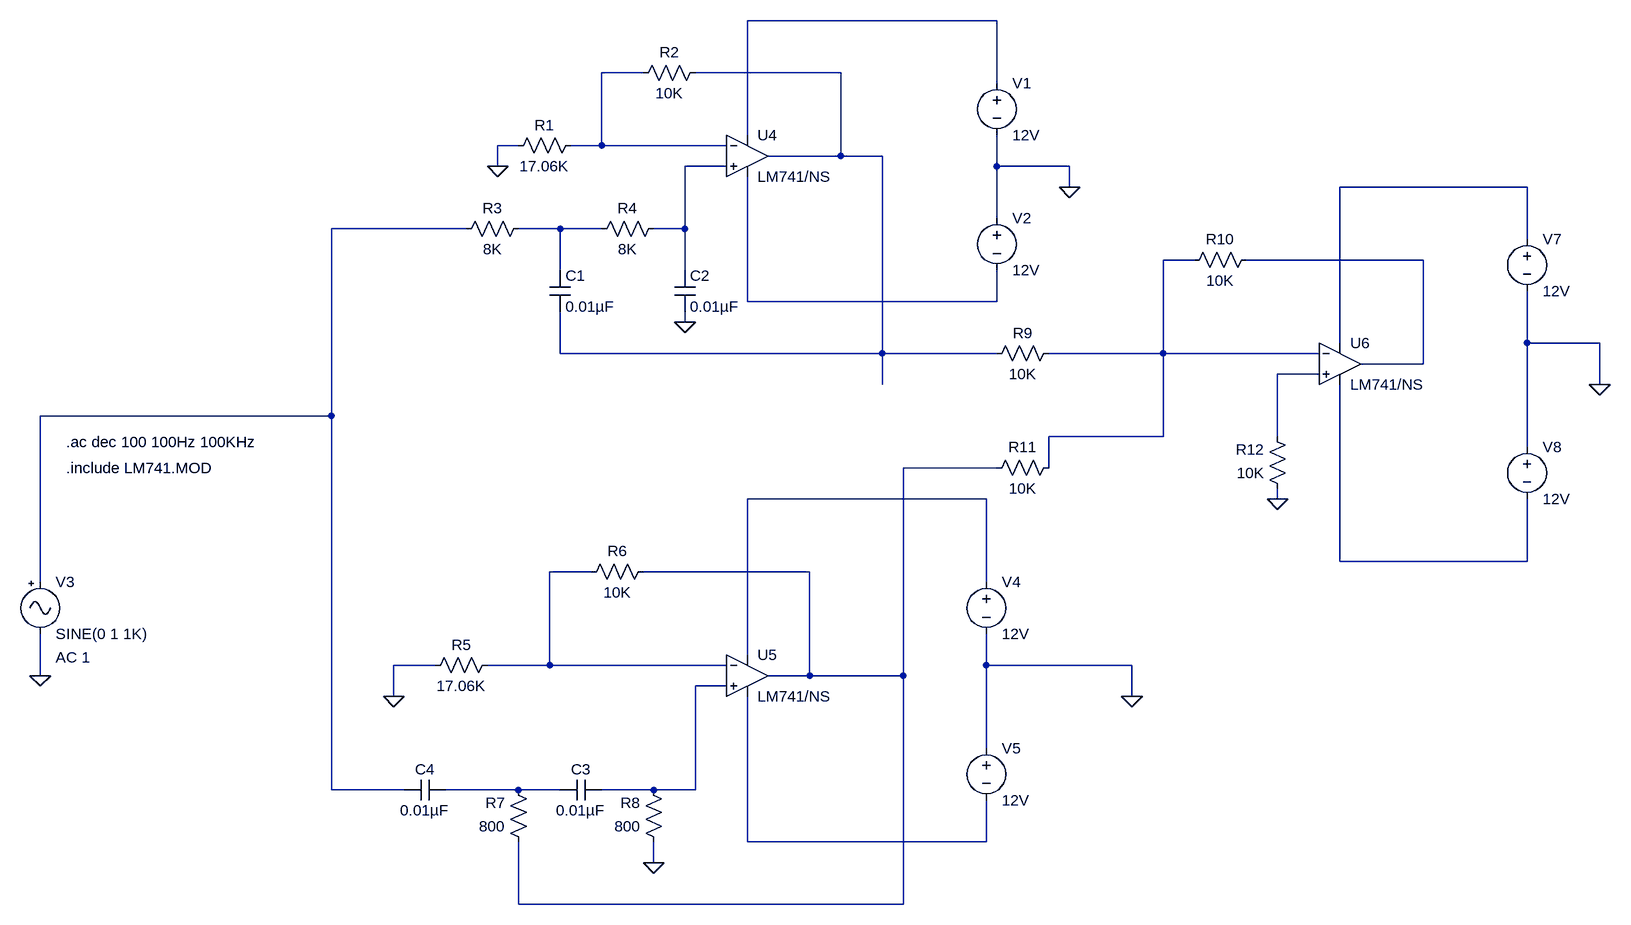
[diagram p0: schematic Band Reject Filter.asc]
Band Reject Filter.asc, the LTspice schematic file:
Version 4
SHEET 1 2224 1444
WIRE 608 -16 224 -16
WIRE 64 64 0 64
WIRE 368 64 144 64
WIRE 608 80 608 -16
WIRE 224 160 224 -16
WIRE -128 176 -160 176
WIRE 0 176 0 64
WIRE 0 176 -48 176
WIRE 192 176 0 176
WIRE 368 192 368 64
WIRE 368 192 256 192
WIRE 432 192 368 192
WIRE -160 208 -160 176
WIRE 192 208 128 208
WIRE 608 208 608 160
WIRE 720 208 608 208
WIRE 720 240 720 208
WIRE 1424 240 1136 240
WIRE 608 288 608 208
WIRE -208 304 -416 304
WIRE -64 304 -128 304
WIRE 0 304 -64 304
WIRE 128 304 128 208
WIRE 128 304 80 304
WIRE 1424 320 1424 240
WIRE 912 352 864 352
WIRE 1264 352 992 352
WIRE -64 368 -64 304
WIRE 128 368 128 304
WIRE 224 416 224 224
WIRE 608 416 608 368
WIRE 608 416 224 416
WIRE 128 448 128 432
WIRE 1136 480 1136 240
WIRE 1424 480 1424 400
WIRE 1536 480 1424 480
WIRE -64 496 -64 432
WIRE 432 496 432 192
WIRE 432 496 -64 496
WIRE 608 496 432 496
WIRE 864 496 864 352
WIRE 864 496 688 496
WIRE 1104 496 864 496
WIRE 1264 512 1264 352
WIRE 1264 512 1168 512
WIRE 1104 528 1040 528
WIRE 432 544 432 496
WIRE 1536 544 1536 480
WIRE -416 592 -416 304
WIRE -416 592 -864 592
WIRE 864 624 864 496
WIRE 864 624 688 624
WIRE 1040 624 1040 528
WIRE 1424 640 1424 480
WIRE 608 672 464 672
WIRE 688 672 688 624
WIRE 592 720 224 720
WIRE 1040 720 1040 704
WIRE 1136 816 1136 544
WIRE 1424 816 1424 720
WIRE 1424 816 1136 816
WIRE -16 832 -80 832
WIRE 320 832 64 832
WIRE -864 848 -864 592
WIRE 592 848 592 720
WIRE 224 960 224 720
WIRE -256 976 -320 976
WIRE -80 976 -80 832
WIRE -80 976 -176 976
WIRE 192 976 -80 976
WIRE 592 976 592 928
WIRE 816 976 592 976
WIRE -864 992 -864 928
WIRE 320 992 320 832
WIRE 320 992 256 992
WIRE 464 992 464 672
WIRE 464 992 320 992
WIRE 192 1008 144 1008
WIRE -320 1024 -320 976
WIRE 816 1024 816 976
WIRE 592 1104 592 976
WIRE -416 1168 -416 592
WIRE -304 1168 -416 1168
WIRE -128 1168 -240 1168
WIRE -64 1168 -128 1168
WIRE 80 1168 0 1168
WIRE 144 1168 144 1008
WIRE 144 1168 80 1168
WIRE 224 1248 224 1024
WIRE 592 1248 592 1184
WIRE 592 1248 224 1248
WIRE 80 1280 80 1248
WIRE -128 1344 -128 1248
WIRE 464 1344 464 992
WIRE 464 1344 -128 1344
FLAG 720 240 0
FLAG 128 448 0
FLAG -160 208 0
FLAG 80 1280 0
FLAG -320 1024 0
FLAG 816 1024 0
FLAG 1040 720 0
FLAG -864 992 0
FLAG 1536 544 0
SYMBOL res -32 160 R90
WINDOW 0 0 56 VBottom 2
WINDOW 3 32 56 VTop 2
SYMATTR InstName R1
SYMATTR Value 17.06K
SYMBOL res 160 48 R90
WINDOW 0 0 56 VBottom 2
WINDOW 3 32 56 VTop 2
SYMATTR InstName R2
SYMATTR Value 10K
SYMBOL res -112 288 R90
WINDOW 0 0 56 VBottom 2
WINDOW 3 32 56 VTop 2
SYMATTR InstName R3
SYMATTR Value 8K
SYMBOL res 96 288 R90
WINDOW 0 0 56 VBottom 2
WINDOW 3 32 56 VTop 2
SYMATTR InstName R4
SYMATTR Value 8K
SYMBOL cap -80 368 R0
SYMATTR InstName C1
SYMATTR Value 0.01µF
SYMBOL cap 112 368 R0
SYMATTR InstName C2
SYMATTR Value 0.01µF
SYMBOL voltage 608 64 R0
SYMATTR InstName V1
SYMATTR Value 12V
SYMBOL voltage 608 272 R0
SYMATTR InstName V2
SYMATTR Value 12V
SYMBOL res -160 960 R90
WINDOW 0 0 56 VBottom 2
WINDOW 3 32 56 VTop 2
SYMATTR InstName R5
SYMATTR Value 17.06K
SYMBOL res 80 816 R90
WINDOW 0 0 56 VBottom 2
WINDOW 3 32 56 VTop 2
SYMATTR InstName R6
SYMATTR Value 10K
SYMBOL res -112 1264 R180
WINDOW 0 36 76 Left 2
WINDOW 3 36 40 Left 2
SYMATTR InstName R7
SYMATTR Value 800
SYMBOL res 96 1264 R180
WINDOW 0 36 76 Left 2
WINDOW 3 36 40 Left 2
SYMATTR InstName R8
SYMATTR Value 800
SYMBOL cap 0 1152 R90
WINDOW 0 0 32 VBottom 2
WINDOW 3 32 32 VTop 2
SYMATTR InstName C3
SYMATTR Value 0.01µF
SYMBOL cap -240 1152 R90
WINDOW 0 0 32 VBottom 2
WINDOW 3 32 32 VTop 2
SYMATTR InstName C4
SYMATTR Value 0.01µF
SYMBOL voltage 592 832 R0
SYMATTR InstName V4
SYMATTR Value 12V
SYMBOL voltage 592 1088 R0
SYMATTR InstName V5
SYMATTR Value 12V
SYMBOL res 1056 720 R180
WINDOW 0 36 76 Left 2
WINDOW 3 36 40 Left 2
SYMATTR InstName R12
SYMATTR Value 10K
SYMBOL voltage 1424 304 R0
SYMATTR InstName V7
SYMATTR Value 12V
SYMBOL voltage 1424 624 R0
SYMATTR InstName V8
SYMATTR Value 12V
SYMBOL Misc\\signal -864 832 R0
WINDOW 123 24 132 Left 2
WINDOW 39 0 0 Left 0
SYMATTR Value2 AC 1
SYMATTR InstName V3
SYMBOL res 704 480 R90
WINDOW 0 0 56 VBottom 2
WINDOW 3 32 56 VTop 2
SYMATTR InstName R9
SYMATTR Value 10K
SYMBOL res 1008 336 R90
WINDOW 0 0 56 VBottom 2
WINDOW 3 32 56 VTop 2
SYMATTR InstName R10
SYMATTR Value 10K
SYMBOL res 704 656 R90
WINDOW 0 0 56 VBottom 2
WINDOW 3 32 56 VTop 2
SYMATTR InstName R11
SYMATTR Value 10K
SYMBOL OpAmps\\opamp2 224 128 R0
SYMATTR InstName U4
SYMATTR Value LM741/NS
SYMBOL OpAmps\\opamp2 224 928 R0
SYMATTR InstName U5
SYMATTR Value LM741/NS
SYMBOL OpAmps\\opamp2 1136 448 R0
SYMATTR InstName U6
SYMATTR Value LM741/NS
TEXT -824 632 Left 2 !.ac dec 100 100Hz 100KHz
TEXT -824 672 Left 2 !.include LM741.MOD

The netlist it stands for:
* Band Reject Filter.asc
R1 N002 0 17.06K
R2 N003 N002 10K
R3 N007 N006 8K
R4 N004 N007 8K
C1 N007 N003 0.01µF
C2 N004 0 0.01µF
V1 N001 0 12V
V2 0 N010 12V
R5 N015 0 17.06K
R6 N012 N015 10K
R7 N012 N017 800
R8 0 N016 800
C3 N016 N017 0.01µF
C4 N017 N006 0.01µF
V4 N013 0 12V
V5 0 N018 12V
R12 0 N011 10K
V7 N005 0 12V
V8 0 N014 12V
V3 N006 0 SINE(0 1 1K) AC 1
R9 N008 N003 10K
R10 N009 N008 10K
R11 N008 N012 10K
XU4 N004 N002 N001 N010 N003 LM741/NS  ; pins In+ In- V+ V- OUT
XU5 N016 N015 N013 N018 N012 LM741/NS  ; pins In+ In- V+ V- OUT
XU6 N011 N008 N005 N014 N009 LM741/NS  ; pins In+ In- V+ V- OUT
.ac dec 100 100Hz 100KHz
.include LM741.MOD
.backanno
.end